# Altium schematic sheet PC104.SchDoc
size 297 x 209 mm; SheetNumber: 11; SheetTotal: 11
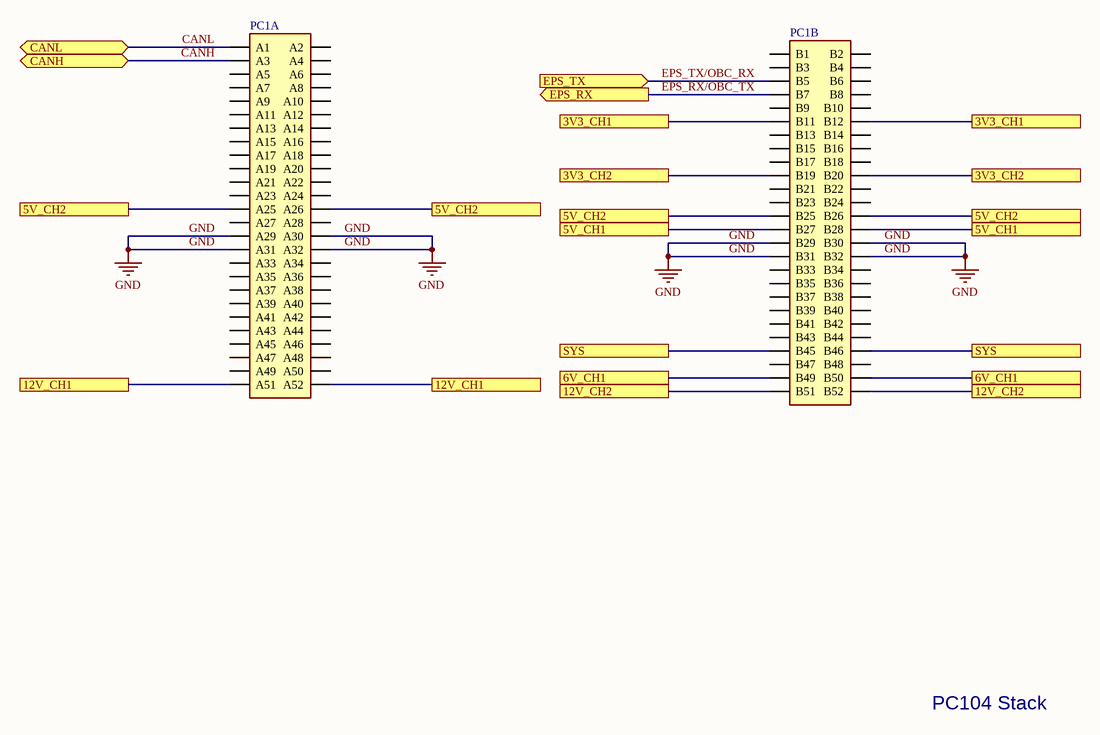
[diagram p0: PC104.SchDoc]

## Parts
PC1  SSQ-126-21-G-D  [PC104 STACK HEADER]  (value not drawn)  (parts A,B of 2)

## Ports
3V3_CH1 (see PDM[2C], 3V3_Supply[6B]), 3V3_CH2 (see PDM[2C], 3V3_Supply[6C]), 5V_CH1 (see PDM[2C], 5V_Supply[6B]), 5V_CH2 (see PDM[2C], 5V_Supply[6B]), 6V_CH1 (see PDM[2C], 6V_Supply[6B]), 12V_CH1 (see PDM[2C], 12V_Supply[6B]), 12V_CH2 (see PDM[2C], 12V_Supply[6C]), CANH (bidir, see PDM[3C], Controller[6C]), CANL (bidir, see PDM[3C], Controller[6C]), EPS_RX (out, see PDM[3C], Controller[3B]), EPS_TX (in, see PDM[3C], Controller[3B]), SYS (see PDM[2C], 3V3_Supply[1B], 5V_Supply[1A], 6V_Supply[1B], 12V_Supply[1A])

## Nets
GND: PC1.A29 PC1.A30 PC1.A31 PC1.A32 PC1.B29 PC1.B30 PC1.B31 PC1.B32
3V3_CH1: PC1.B11 PC1.B12 ; port 3V3_CH1
3V3_CH2: PC1.B19 PC1.B20 ; port 3V3_CH2
5V_CH1: PC1.B27 PC1.B28 ; port 5V_CH1
5V_CH2: PC1.A25 PC1.A26 PC1.B25 PC1.B26 ; port 5V_CH2
6V_CH1: PC1.B49 PC1.B50 ; port 6V_CH1
12V_CH1: PC1.A51 PC1.A52 ; port 12V_CH1
12V_CH2: PC1.B51 PC1.B52 ; port 12V_CH2
CANH: PC1.A3 ; port CANH
CANL: PC1.A1 ; port CANL
EPS_RX/OBC_TX: PC1.B7 ; port EPS_RX
EPS_TX/OBC_RX: PC1.B5 ; port EPS_TX
SYS: PC1.B45 PC1.B46 ; port SYS

Not connected (* = marked no-connect by the designer): PC1 A2 A4 A5 A6 A7 A8 A9 A10 A11 A12 A13 A14 A15 A16 A17 A18 A19 A20 A21 A22 A23 A24 A27 A28 A33 A34 A35 A36 A37 A38 A39 A40 A41 A42 A43 A44 A45 A46 A47 A48 A49 A50 B1 B2 B3 B4 B6 B8 B9 B10 B13 B14 B15 B16 B17 B18 B21 B22 B23 B24 B33 B34 B35 B36 B37 B38 B39 B40 B41 B42 B43 B44 B47 B48

## Notes on the sheet
- PC104 Stack
- Size:
- Title:
- A4
- Project:
- Rev:
- Date:
- Drawn By:
- Sheet:
- of

## Library data of the parts
PC1 = PC104: PC104 stack header, 2.54mm 4x26positions; Current Rating: 6.3A; Number of Positions: 52; Voltage Rating (AC): 465V; Voltage Rating (DC): 655V; Part Number: SSQ-126-21-G-D; Distributor Part Number: SSQ-126-21-G-D-ND; Distributor: Digikey; Operating Temperature: -55°C ~ 125°C; Number of Rows: 2